# EasyEDA Pro project pcb easy eda pro stm32wb5mmg01 - Elektor.eprj, board PCB4
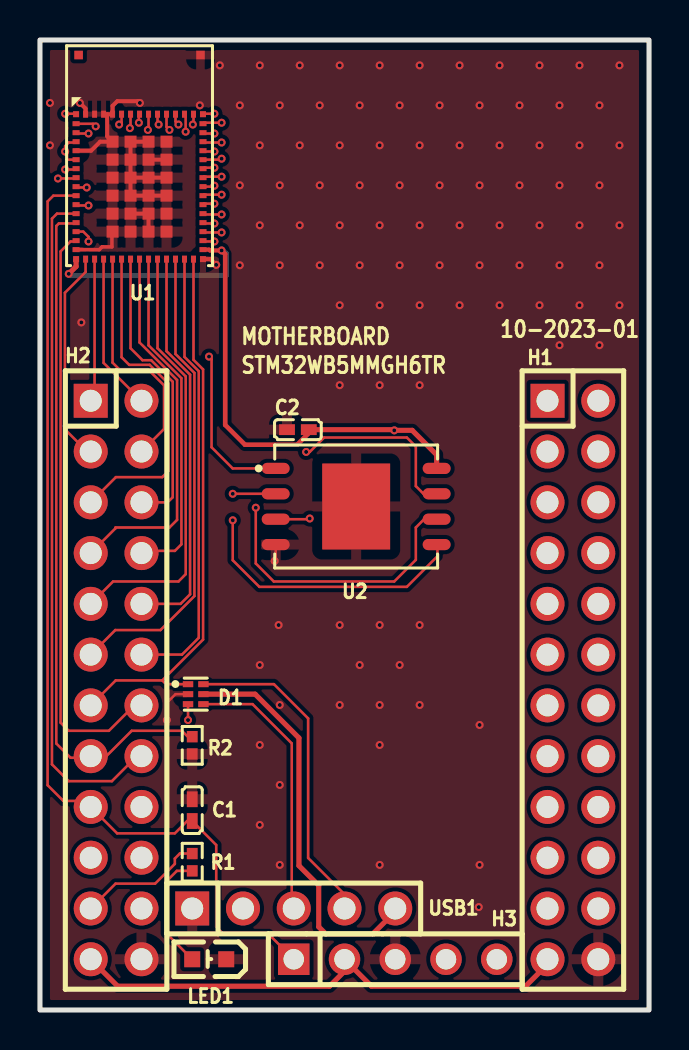
[diagram p3: board, top side]
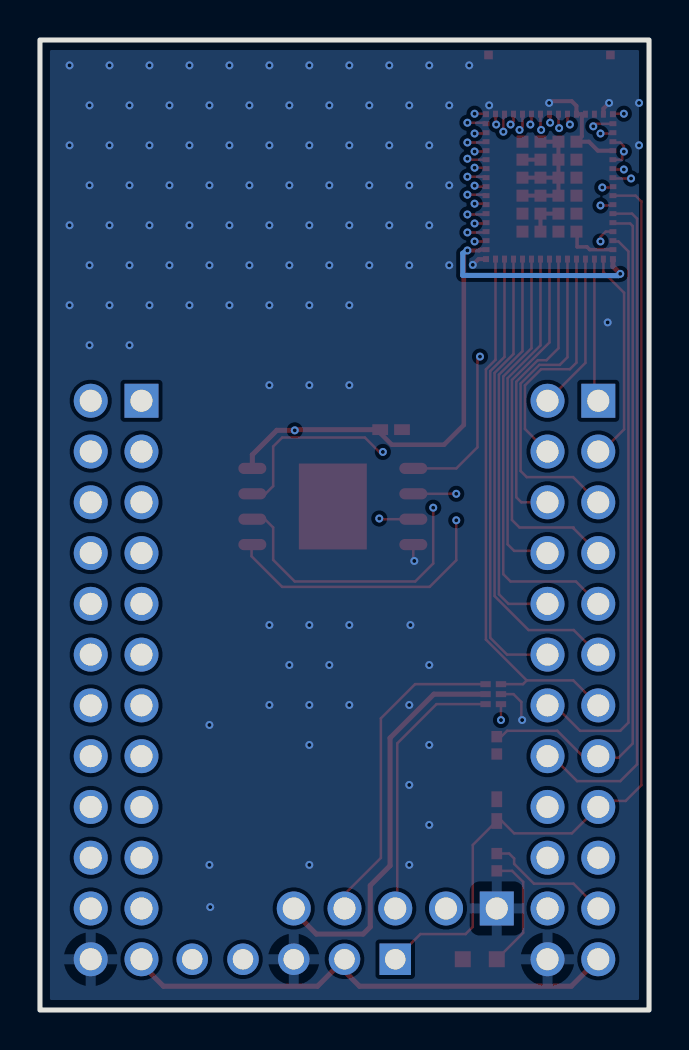
[diagram p4: board, bottom side, seen from below]

Outline 30.48 x 48.53 mm; copper layers: Top Layer, Inner1, Inner2, Bottom Layer. Coordinates in mm from the lower left corner of the outline.
Outline path: rectangle 0,48.53 30.48,0
Stack: Top Layer 0.035mm / Dielectric1 0.48mm PP er 4.5 / Inner1 0.035mm / Dielectric2 0.48mm FR4 er 4.5 / Inner2 0.035mm / Dielectric3 0.48mm PP er 4.5 / Bottom Layer 0.035mm

## Design rules (mm)
template: Custom Config
spacing copperThickness1oz (default): track to track 0.089, other pairs 0.089 to 0.3
spacing copperThickness2oz: track to track 0.203, other pairs 0.152 to 0.3
track width copperThickness1oz (default): min 0.127, default 0.254, max 2.54
track width copperThickness2oz: min 0.203, default 0.254, max 2.54
differential pair differentialPair (default): width min 0.127, default 0.254, max 2.54; gap min 0.152, default 0.152
via viaSize (default): diameter min 0.399, default 0.61, max 10; hole min 0.201, default 0.305, max 6.299

## Placement (name value [footprint] x y rotation side)
C1  100nF  [C0402]  7.62 10 270 top
C2  100nF  [C0402]  12.91 29.03 0 top
D1  PRTR5V0U2F  [SON-6_L1.5-W1.0-P0.50-BL]  7.79 15.8 270 top
H1  PZ254-2-12-Z-8.5  [HDR-TH_24P-P2.54-V-M-R2-C12-S2.54]  26.67 16.51 270 top
H2  PZ254-2-12-Z-8.5  [HDR-TH_24P-P2.54-V-M-R2-C12-S2.54]  3.81 16.51 270 top
H3  -  [HDR-TH_5P-P2.54-V-F]  17.78 2.54 0 top
LED1  19-217/R6C-AL1M2VY/3T  [LED0603-R-RD]  8.47 2.54 180 top
R1  300Ω  [R0402]  7.62 7.39 90 top
R2  10kΩ  [R0402]  7.62 13.24 90 top
U1  STM32WB5MMGH6TR  [LCC-LGA-86_L11.0-W7.3_STM32WB5MMGH6TR]  4.98 42.67 0 top
U2  W25Q256JVEIQ  [WSON-8_L8.0-W6.10-P1.27-BL-EP]  15.82 25.19 270 top
USB1  -  [HDR-TH_5P-P2.54-V-M]  12.7 5.08 0 top

## Footprints (pads in the part's own frame, mm; a bottom-side part is the same pattern mirrored in y, then rotated)
C0402
  rect 0.79x0.54 smd: 1(-0.545,0) 2(0.545,0)
HDR-TH_5P-P2.54-V-F
  rect 1.575x1.575 hole 1.02: 1(-5.08,0)
  round 1.575 hole 1.02: 2(-2.54,0) 3(0,0) 4(2.54,0) 5(5.08,0)
HDR-TH_5P-P2.54-V-M
  rect 1.7x1.7 hole 1.1: 1(-5.08,0)
  round 1.7 hole 1.1: 2(-2.54,0) 3(0,0) 4(2.54,0) 5(5.08,0)
HDR-TH_24P-P2.54-V-M-R2-C12-S2.54
  rect 1.7x1.7 hole 1.1: 1(-13.97,-1.27)
  round 1.7 hole 1.1: 2(-13.97,1.27) 3(-11.43,-1.27) 4(-11.43,1.27) 5(-8.89,-1.27) 6(-8.89,1.27) 7(-6.35,-1.27) 8(-6.35,1.27) 9(-3.81,-1.27) 10(-3.81,1.27) 11(-1.27,-1.27) 12(-1.27,1.27) 13(1.27,-1.27) 14(1.27,1.27) 15(3.81,-1.27) 16(3.81,1.27) 17(6.35,-1.27) 18(6.35,1.27) 19(8.89,-1.27) 20(8.89,1.27) 21(11.43,-1.27) 22(11.43,1.27) 23(13.97,-1.27) 24(13.97,1.27)
LCC-LGA-86_L11.0-W7.3_STM32WB5MMGH6TR
  rect 0.3x0.3 smd: 1(-3.175,2.145) 17(-3.175,-5.105) 31(3.175,-5.105) 47(3.175,2.145)
  rect 0.35x0.25 smd: 2(-3.175,1.67) 3(-3.175,1.22) 4(-3.175,0.77) 5(-3.175,0.32) 6(-3.175,-0.13) 7(-3.175,-0.58) 8(-3.175,-1.03) 9(-3.175,-1.48) 10(-3.175,-1.93) 11(-3.175,-2.38) 12(-3.175,-2.83) 13(-3.175,-3.28) 14(-3.175,-3.73) 15(-3.175,-4.18) 16(-3.175,-4.63) 32(3.175,-4.63) 33(3.175,-4.18) 34(3.175,-3.73) 35(3.175,-3.28) 36(3.175,-2.83) 37(3.175,-2.38) 38(3.175,-1.93) 39(3.175,-1.48) 40(3.175,-1.03) 41(3.175,-0.58) 42(3.175,-0.13) 43(3.175,0.32) 44(3.175,0.77) 45(3.175,1.22) 46(3.175,1.67)
  rect 0.25x0.35 smd: 18(-2.7,-5.105) 19(-2.25,-5.105) 20(-1.8,-5.105) 21(-1.35,-5.105) 22(-0.9,-5.105) 23(-0.45,-5.105) 24(0,-5.105) 25(0.45,-5.105) 26(0.9,-5.105) 27(1.35,-5.105) 28(1.8,-5.105) 29(2.25,-5.105) 30(2.7,-5.105) 48(2.7,2.145) 49(2.25,2.145) 50(1.8,2.145) 51(1.35,2.145) 52(0.9,2.145) 53(0.45,2.145) 54(0,2.145) 55(-0.45,2.145) 56(-0.9,2.145) 57(-1.35,2.145) 58(-1.8,2.145) 59(-2.25,2.145) 60(-2.7,2.145)
  rect 0.6x0.6 smd: 61(-1.35,0.77) 62(-1.35,-0.13) 63(-1.35,-1.03) 64(-1.35,-1.93) 65(-1.35,-2.83) 66(-1.35,-3.73) 67(-0.45,-3.73) 68(0.45,-3.73) 69(1.35,-3.73) 70(1.35,-2.83) 71(1.35,-1.93) 72(1.35,-1.03) 73(1.35,-0.13) 74(1.35,0.77) 75(0.45,0.77) 76(-0.45,0.77) 77(-0.45,-0.13) 78(-0.45,-1.03) 79(-0.45,-1.93) 80(-0.45,-2.83) 81(0.45,-2.83) 82(0.45,-1.93) 83(0.45,-1.03) 84(0.45,-0.13)
  rect 0.43x0.43 smd: 85(-3.05,5.105) 86(3.05,5.105)
LED0603-R-RD
  rect 0.8x0.8 smd: 1(0.851,0) 2(-0.851,0)
R0402
  rect 0.566x0.54 smd: 1(-0.433,0) 2(0.433,0)
SON-6_L1.5-W1.0-P0.50-BL
  rect 0.3x0.52 smd: 1(-0.5,-0.385) 2(0,-0.385) 3(0.5,-0.385) 4(0.5,0.385) 5(0,0.385) 6(-0.5,0.385)
WSON-8_L8.0-W6.10-P1.27-BL-EP
  oval 0.56x1.4 smd: 1(-1.905,-4.027) 2(-0.635,-4.027) 3(0.635,-4.027) 4(1.905,-4.027) 5(1.905,4.027) 6(0.635,4.027) 7(-0.635,4.027) 8(-1.905,4.027)
  rect 4.3x3.4 smd: 9(0,0)

## Nets
GND: C1.1 C2.1 D1.2 H1.24 H2.24 H3.3 LED1.2 R2.1 U1.5 U1.16 U1.31 U1.57 U1.58 U1.59 U1.60 U1.61 U1.62 U1.63 U1.64 U1.65 U1.66 U1.67 U1.68 U1.69 U1.70 U1.71 U1.72 U1.73 U1.74 U1.75 U1.76 U1.77 U1.78 U1.79 U1.80 U1.81 U1.82 U1.83 U1.84 U1.86 U2.4 U2.9 USB1.1
VBAT: H2.14 U1.15
VBUS: D1.5 USB1.5
VCC: C2.2 H1.23 H2.23 H3.2 U1.4 U1.6 U1.17 U1.32 U2.8
BOOT0: H2.15 R2.2 U1.13
D+: D1.4 USB1.3
D-: D1.6 USB1.4
I2C1_SCL: H1.8 U1.39
I2C1_SDA: H2.3 U1.18
I2C3_SCL: H1.4 U1.35
I2C3_SDA: H1.6 U1.37
IO: USB1.2
LED: H2.21 R1.2
LPTIM1_IN1: H2.1 U1.19
LPTIM2_IN1: H2.16 U1.12
LPUART1_RX: H1.16 U1.47
LPUART1_TX: H1.13 U1.46
NRST: C1.2 H2.17 H3.1 U1.10
PA0: H2.22 U1.3
PA1: H1.22 U1.2
PA8: H1.17 U1.50
PA15: H2.10 U1.27
PB0: H1.11 U1.44
PB1: H1.12 U1.43
PB2: H1.15 U1.48
PB12: H1.10 U1.41
PB15: H1.5 U1.38
PC1: H2.20 U1.9
PC4: H1.18 U1.49
PC5: H1.14 U1.45
PC6: H1.3 U1.36
PC10: H2.5 U1.22
PC11: H2.6 U1.23
PC12: H2.7 U1.24
PC13: H1.7 U1.40
PE4: H1.9 U1.42
QSPI_CLK: U1.56 U2.6
QSPI_CS: U1.1 U2.1
QSPI_IO0: U1.11 U2.5
QSPI_IO1: U1.14 U2.2
QSPI_IO2: U1.52 U2.3
QSPI_IO3: U1.53 U2.7
SPI1_CS: H1.21 U1.55
SPI1_SCK: H1.20 U1.54
SPI2_CS: H1.2 U1.33
SPI2_MISO: H2.18 U1.8
SPI2_MOSI: H2.19 U1.7
SPI2_SCK: H1.1 U1.34
SWDCK: H2.9 H3.5 U1.26
SWDIO: H2.8 H3.4 U1.25
USART1_CTS: H2.2 U1.20
USART1_RTS: H2.4 U1.21
USART1_RX: H2.11 U1.28
USART1_TX: H1.19 U1.51
USBN: D1.1 H2.13 U1.30
USBP: D1.3 H2.12 U1.29
$1N994: LED1.1 R1.1

Pads without a net: U1 85

## Via types
v1: diameter 0.4, hole 0.2, Top Layer to Bottom Layer, 146 vias

## Routing (per net, layer and track width the routed paths; a pad name or vN(x,y) marks a point on that pad's centre or on a via; arc(x,y) is an arc through that point)
GND: length 22.6
  Top Layer w0.127: v1(11.75,22.47) 11.8,22.51 U2.4 ; D1.2 6.78,15.8 6.39,15.41 6.39,14.55 v1(6.35,14.51)
  Top Layer w0.178: U1.16 2.97,38.04 3.11,38.18 3.6,38.18 3.6,38.91 U1.66
  Top Layer w0.203: U1.68 U1.81 4.53,39.84 ; U1.73 U1.84 ; U1.75 4.53,43.44 4.53,41.64 ; U1.71 U1.82 4.53,40.74 4.53,41.64 ; U1.5 2.56,42.99 3.01,43.44 U1.61 3.36,43.71 3.36,44.82 U1.57 3.63,45.23 3.87,45.47 4.91,45.47 v1(5,45.38) ; 4.53,41.64 U1.83 U1.72 ; U1.60 2.28,45.1 v1(2,45.38) ; v1(8.82,37.28) 8.53,37.57 U1.31
  vias: v1(0.5,45.38) v1(0.5,43.26) v1(2.07,34.4) v1(8,45.26) v1(9,47.26) v1(10,45.26) v1(10,41.26) v1(10,37.26) v1(11,47.26) v1(11,43.26) v1(11,39.26) v1(11,17.26) v1(11,13.26) v1(11,9.26) v1(11.94,19.26) v1(12,45.26) v1(12,41.26) v1(12,37.26) v1(12,15.26) v1(12,11.26) v1(12,7.26) v1(13,47.26) v1(13,43.26) v1(13,39.26) v1(14,45.26) v1(14,41.26) v1(14,37.26) v1(15,47.26) v1(15,43.26) v1(15,39.26) v1(15,35.26) v1(15,31.26) v1(15,19.26) v1(15,15.26) v1(16,45.26) v1(16,41.26) v1(16,37.26) v1(16,17.26) v1(17,47.26) v1(17,43.26) v1(17,39.26) v1(17,35.26) v1(17,31.26) v1(17,19.26) v1(17,15.26) v1(17,13.26) v1(17,7.26) v1(18,45.26) v1(18,41.26) v1(18,37.26) v1(18,17.26) v1(19,47.26) v1(19,43.26) v1(19,39.26) v1(19,35.26) v1(19,31.26) v1(19,19.26) v1(19,15.26) v1(20,45.26) v1(20,41.26) v1(20,37.26) v1(21,47.26) v1(21,43.26) v1(21,39.26) v1(21,35.26) v1(22,45.26) v1(22,41.26) v1(22,37.26) v1(22,14.26) v1(22,7.26) v1(21.96,5.15) v1(23,47.26) v1(23,43.26) v1(23,39.26) v1(23,35.26) v1(24,45.26) v1(24,41.26) v1(24,37.26) v1(25,47.26) v1(25,43.26) v1(25,39.26) v1(25,35.26) v1(26,45.26) v1(26,41.26) v1(26,37.26) v1(26,33.26) v1(27,47.26) v1(27,43.26) v1(27,39.26) v1(27,35.26) v1(28,45.26) v1(28,41.26) v1(28,37.26) v1(28,33.26) v1(29,47.26) v1(29,43.26) v1(29,39.26) v1(29,35.26)
VBAT: length 29
  Top Layer w0.127: U1.15 1.77,38.45 1.53,38.45 1.03,37.95 1.03,14.38 1.44,13.97 3.45,13.97 4.72,15.24
VBUS: length 20.1
  Top Layer w0.254: D1.5 10.77,15.8 12.96,13.61 12.96,7.22 13.95,6.23 13.95,4.16 14.31,3.8 16.65,3.8 17.78,4.93 USB1.5
VCC: length 101.7
  Top Layer w0.127: U1.6 1.35,42.54 1.35,42.86 v1(1.26,42.95) 1.26,43.22 1.44,43.4 1.77,43.4 U1.4
  Top Layer w0.203: U1.32 8.46,38.04 8.5,38 v1(9.09,38)
  Top Layer w0.229: v1(9.09,38) 9.27,37.82 9.27,29.27 10.26,28.28 12.87,28.28 13.45,28.86 C2.2
  Top Layer w0.254: v1(1.44,36.83) 1.81,37.2 U1.17 ; H2.23 3.89,1.19 14.49,1.19 15.24,1.94 H3.2 16.59,1.19 24.3,1.19 25.4,2.29 H1.23 ; C2.2 17.7,29.03 v1(17.73,29) 18.63,29 19.85,27.78 U2.8
  Inner2 w0.254: v1(1.26,42.95) 1.8,42.41 1.8,37.01 1.62,36.83 v1(1.44,36.83) 0.99,36.38 0.99,4.09 H2.23
  Bottom Layer w0.254: v1(1.44,36.83) 1.53,36.74 9.32,36.75 9.32,37.86 v1(9.09,38)
BOOT0: length 34.5
  Top Layer w0.127: U1.13 1.77,39.35 0.94,39.35 0.82,39.22 0.82,13.33 1.53,12.62 2.46,12.62 H2.15 3.32,12.7 4.59,13.97 7.1,13.97 7.4,13.67
D+: length 13.5
  Top Layer w0.127: 12.69,5.09 12.6,5.18 12.6,13.34 10.64,15.3 D1.4
D-: length 16.2
  Top Layer w0.127: D1.6 11.71,16.3 13.42,14.59 13.42,7.61 15.24,5.79 USB1.4
I2C1_SCL: length 38.4
  Top Layer w0.127: v1(8.73,41.24) 8.68,41.19 U1.39
  Inner2 w0.127: v1(8.73,41.24) 7.54,41.24 6.89,40.59 6.89,36.78 8.97,34.69 21.09,34.69 22.37,33.41 22.37,25.17 23.4,24.14 27.02,24.14 27.94,23.22 H1.8
I2C1_SDA: length 10.7
  Top Layer w0.127: U1.18 2.28,36.92 1.25,35.88 1.25,29.05 2.36,27.94 H2.3
I2C3_SCL: length 31.2
  Top Layer w0.127: v1(8.73,39.35) 8.2,39.35 U1.35
  Inner2 w0.127: H1.4 26.79,29.09 24.3,29.09 23.67,29.72 23.67,35.84 23.11,36.4 8.5,36.4 7.76,37.14 7.76,39.04 8.06,39.35 v1(8.73,39.35)
I2C3_SDA: length 34.5
  Top Layer w0.127: U1.37 8.21,40.34 v1(8.73,40.34)
  Inner2 w0.127: v1(8.73,40.34) 7.74,40.34 7.32,39.92 7.32,36.96 8.31,35.97 21.65,35.97 22.81,34.81 22.81,27.97 24.12,26.66 26.64,26.66 27.9,25.4 H1.6
LED: length 6.4
  Top Layer w0.127: R1.2 7,7.83 6.75,7.58 6.75,7.31 5.76,6.32 3.78,6.32 H2.21
LPTIM1_IN1: length 7.2
  Top Layer w0.127: H2.1 2.73,30.67 U1.19
LPTIM2_IN1: length 34
  Top Layer w0.127: U1.12 0.85,39.84 0.6,39.59 0.6,12.29 1.44,11.45 3.6,11.45 4.85,12.7 H2.16
LPUART1_RX: length 52.8
  Top Layer w0.127: U1.47 8.18,44.84 v1(8.73,44.84)
  Inner2 w0.127: v1(8.73,44.84) 7.47,43.58 6.51,43.58 5.15,42.22 5.15,35.37 8.28,32.24 20.34,32.24 20.64,31.94 20.64,17.41 24.17,13.88 26.67,13.88 27.85,12.7 H1.16
LPUART1_TX: length 48
  Top Layer w0.127: v1(9.09,44.39) 8.21,44.39 U1.46
  Inner2 w0.127: v1(9.09,44.39) 8.68,44.39 7.65,43.36 6.6,43.36 5.37,42.13 5.37,36.14 8.33,33.18 20.47,33.18 20.86,32.79 20.86,19.59 25.21,15.23 25.39,15.23 H1.13
NRST: length 49.4
  Top Layer w0.127: U1.10 0.67,40.74 0.38,40.45 0.38,11.25 1.17,10.46 2.24,10.46 H2.17 3.86,8.84 6.75,8.84 7.37,9.45 7.41,9.45 ; H3.1 11.44,3.8 9.18,3.8 8.82,4.16 8.82,8.25 C1.2
PA0: length 47.6
  Top Layer w0.127: U1.3 1.85,43.85 v1(2.43,43.85)
  Inner1 w0.127: H2.22 6.34,6.34 8.75,6.34 10.23,7.82 10.23,33.76 9.77,34.22 7.37,34.22 3.11,38.48 3.11,43.17 v1(2.43,43.85)
PA1: length 63.1
  Top Layer w0.127: U1.2 1.81,44.34 2.66,44.34 v1(2.79,44.21)
  Inner1 w0.127: H1.22 27.92,5.08 26.64,3.8 12.01,3.8 11.39,4.42 11.39,5.77 10.45,6.72 10.45,33.85 9.86,34.44 7.46,34.44 3.74,38.15 3.74,43.26 v1(2.79,44.21)
PA8: length 50.1
  Top Layer w0.127: U1.50 6.78,44.45 v1(6.93,44.3)
  Inner1 w0.127: v1(6.93,44.3) 6.93,37.12 8.1,35.95 13.59,35.95 14.15,35.39 14.15,13.74 15.52,12.36 23.2,12.36 25.4,10.16 H1.17
PA15: length 19.9
  Top Layer w0.127: H2.10 7.03,20.32 7.51,20.8 7.51,31.78 6.33,32.96 U1.27
PB0: length 45.5
  Top Layer w0.127: U1.44 8.2,43.4 v1(9.09,43.4)
  Inner2 w0.127: v1(9.09,43.4) 8.55,43.4 8.08,42.93 6.78,42.93 5.8,41.95 5.8,36.32 8.51,33.61 20.65,33.61 21.29,32.96 21.29,19.77 23.13,17.93 25.25,17.93 H1.11
PB1: length 46.1
  Top Layer w0.127: v1(8.73,42.95) 8.2,42.95 U1.43
  Inner2 w0.127: H1.12 26.62,19.1 23.13,19.1 21.51,20.72 21.51,33.05 20.74,33.83 8.6,33.83 6.02,36.41 6.02,41.86 6.88,42.72 8.5,42.72 v1(8.73,42.95)
PB2: length 48.3
  Top Layer w0.127: v1(7.65,44.3) 7.68,44.33 U1.48
  Inner1 w0.127: H1.15 25.3,12.8 15.75,12.8 14.58,13.97 14.58,35.57 13.77,36.38 8.28,36.38 7.65,37.01 v1(7.65,44.3)
PB12: length 42.4
  Top Layer w0.127: U1.41 8.21,42.14 v1(8.73,42.14)
  Inner2 w0.127: 21.94,33.23 20.91,34.26 8.78,34.26 6.45,36.59 6.45,41.3 7.29,42.14 v1(8.73,42.14) ; H1.10 26.82,21.44 23.04,21.44 21.94,22.54 21.94,33.23
PB15: length 33.9
  Top Layer w0.127: v1(9.09,40.79) 8.21,40.79 U1.38
  Inner2 w0.127: H1.5 24.21,25.4 22.59,27.02 22.59,34.36 21.21,35.75 8.22,35.75 7.1,36.87 7.1,40.33 7.56,40.79 v1(9.09,40.79)
PC1: length 40.7
  Top Layer w0.127: U1.9 1.85,41.15 v1(2.34,41.15)
  Inner1 w0.127: H2.20 5.12,7.58 5.58,7.58 9.29,11.29 9.29,33.15 8.89,33.55 6.74,33.55 1.93,38.36 1.93,40.74 v1(2.34,41.15)
PC4: length 52.3
  Top Layer w0.127: v1(7.29,43.94) 7.29,44.76 U1.49
  Inner1 w0.127: v1(7.29,43.94) 7.29,37.06 8.19,36.16 13.68,36.16 14.36,35.48 14.36,13.83 15.61,12.58 23.58,12.58 24.75,11.41 26.69,11.41 H1.18
PC5: length 49.1
  Top Layer w0.127: v1(8.73,43.85) 8.2,43.85 U1.45
  Inner2 w0.127: v1(8.73,43.85) 8.55,43.85 7.85,43.15 6.69,43.15 5.59,42.04 5.59,36.23 8.42,33.39 20.56,33.39 21.08,32.88 21.08,19.68 24.35,16.4 26.64,16.4 27.8,15.24 H1.14
PC6: length 30.6
  Top Layer w0.127: v1(9.09,39.8) 8.2,39.8 U1.36
  Inner2 w0.127: v1(9.09,39.8) 7.92,39.8 7.54,39.42 7.54,37.05 8.4,36.18 23.02,36.18 23.45,35.75 23.45,28.95 24.46,27.94 H1.3
PC10: length 16.7
  Top Layer w0.127: U1.22 4.08,32.66 4.46,32.28 5.49,32.28 6.43,31.34 6.43,26.97 6.12,26.66 3.8,26.66 H2.5
PC11: length 14.7
  Top Layer w0.127: 4.53,37.57 4.53,33.11 5.13,32.51 5.56,32.51 6.64,31.43 6.64,25.65 6.39,25.4 H2.6
PC12: length 18.9
  Top Layer w0.127: H2.7 3.78,24.1 3.78,24.14 6.48,24.14 6.86,24.52 6.86,31.52 4.98,33.4 U1.24
PC13: length 37.9
  Top Layer w0.127: U1.40 8.21,41.69 v1(9.09,41.69)
  Inner2 w0.127: v1(9.09,41.69) 7.51,41.69 6.67,40.86 6.67,36.69 8.88,34.47 21,34.47 22.16,33.32 22.16,23.94 23.31,22.79 25.33,22.79 H1.7
PE4: length 42.6
  Top Layer w0.127: U1.42 9.04,42.54 v1(9.09,42.59)
  Inner2 w0.127: H1.9 25.26,20.18 22.36,20.18 21.73,20.81 21.73,33.14 20.82,34.04 8.69,34.04 6.24,36.5 6.24,41.72 7.02,42.5 9,42.5 v1(9.09,42.59)
QSPI_CLK: length 38.4
  Top Layer w0.127: v1(10.8,25.13) 10.8,22.34 11.7,21.44 17.73,21.44 18.81,22.52 18.81,24.14 19.23,24.56 U2.6 ; v1(3.96,44.3) 4.08,44.42 U1.56
  Inner1 w0.127: v1(3.96,44.3) 3.96,38.24 7.55,34.65 9.95,34.65 10.66,33.94 10.66,25.27 v1(10.8,25.13)
QSPI_CS: length 25.6
  Top Layer w0.127: U2.1 9.64,27.1 8.59,28.15 8.59,32.56 v1(8.46,32.69) ; v1(1.26,44.84) 1.78,44.84 U1.1
  Inner1 w0.127: v1(8.46,32.69) 6.68,32.69 1.26,38.11 1.26,40.7 0.55,41.41 0.55,42.78 1.26,43.49 v1(1.26,44.84)
QSPI_IO0: length 35.3
  Top Layer w0.127: U2.5 19.89,23.25 19.89,22.7 18.36,21.17 10.98,21.17 9.65,22.5 v1(9.65,24.5) ; U1.11 1.85,40.25 v1(2.43,40.25)
  Inner1 w0.127: v1(2.43,40.25) 2.7,40.25 2.9,40.05 2.9,38.39 7.28,34 9.68,34 10.01,33.67 10.01,24.87 v1(9.65,24.5)
QSPI_IO1: length 20
  Top Layer w0.127: v1(9.65,25.83) U2.2 ; U1.14 2.17,38.94 2.43,38.68 v1(2.43,38.45)
  Inner1 w0.127: v1(2.43,38.45) 2.53,38.45 7.21,33.77 9.36,33.77 9.63,33.5 9.63,25.84 v1(9.65,25.83)
QSPI_IO2: length 28.5
  Top Layer w0.127: v1(13.5,24.59) 13.47,24.56 U2.3 ; v1(5.94,44.3) 5.88,44.36 U1.52
  Inner1 w0.127: v1(5.94,44.3) 5.94,37.49 7.92,35.52 13.41,35.52 13.72,35.21 13.72,25.3 13.5,25.09 v1(13.5,24.59)
QSPI_IO3: length 32.7
  Top Layer w0.127: v1(5.4,44.03) 5.43,44.06 U1.53 ; v1(13.32,27.92) 13.5,27.92 14.22,28.64 18.36,28.64 18.81,28.19 18.81,26.21 19.19,25.83 U2.7
  Inner1 w0.127: v1(13.32,27.92) 13.5,28.1 13.5,35.12 13.32,35.3 7.82,35.3 5.4,37.73 v1(5.4,44.03)
SPI1_CS: length 56.7
  Top Layer w0.127: 4.53,44.82 4.53,44.15 v1(4.5,44.12)
  Inner1 w0.127: v1(4.5,44.12) 4.5,38.01 7.64,34.87 12.37,34.87 12.75,34.48 12.75,8.24 14.76,6.23 24.25,6.23 H1.21
SPI1_SCK: length 58.6
  Top Layer w0.127: v1(4.95,44.39) 4.95,44.78 U1.54
  Inner1 w0.127: v1(4.95,44.39) 4.95,37.87 7.73,35.08 12.46,35.08 12.97,34.57 12.97,8.65 15.12,6.5 26.73,6.5 27.85,7.62 H1.20
SPI2_CS: length 27.2
  Top Layer w0.127: U1.33 8.2,38.45 v1(8.73,38.45)
  Inner2 w0.127: 27.49,30.93 27.49,36.16 26.82,36.83 8.68,36.83 8.19,37.32 8.19,38.32 8.32,38.45 v1(8.73,38.45)
SPI2_MISO: length 40.4
  Top Layer w0.127: v1(0.9,41.6) 1.77,41.6 U1.8
  Inner1 w0.127: v1(0.9,41.6) 1.49,41.01 1.49,38.18 6.55,33.12 8.71,33.12 8.86,32.97 8.86,11.49 6.93,9.56 5.68,9.56 H2.18
SPI2_MOSI: length 43.8
  Top Layer w0.127: v1(1.26,42.05) 1.77,42.05 U1.7
  Inner1 w0.127: H2.19 3.76,8.84 6.52,8.84 9.08,11.4 9.08,33.06 8.8,33.34 6.65,33.34 1.71,38.27 1.71,41.6 v1(1.26,42.05)
SPI2_SCK: length 27.2
  Top Layer w0.127: U1.34 8.2,38.9 v1(9.09,38.9)
  Inner2 w0.127: H1.1 25.53,30.61 25.53,36.05 24.97,36.61 8.59,36.61 7.97,37.23 7.97,38.5 8.37,38.9 v1(9.09,38.9)
SWDCK: length 65.3
  Top Layer w0.127: U1.26 5.88,33.11 7.29,31.7 7.29,21.8 6.93,21.44 3.66,21.44 H2.9
  Inner2 w0.127: H3.5 22.86,1.91 22.23,1.28 19.71,1.28 18.99,2 18.99,3.53 20.21,4.75 20.21,20.54 19.8,20.95 11.88,20.95 10.19,22.64 7.14,22.64 6.03,21.53 3.75,21.53 H2.9
SWDIO: length 51.5
  Top Layer w0.127: H2.8 5.19,22.97 6.75,22.97 7.08,23.3 7.08,31.61 5.43,33.25 U1.25
  Inner2 w0.127: H3.4 20.43,2.65 20.43,20.63 19.89,21.17 11.97,21.17 10.28,22.86 H2.8
USART1_CTS: length 7.9
  Top Layer w0.127: U1.20 3.18,32.38 H2.2
USART1_RTS: length 12
  Top Layer w0.127: H2.4 6.21,29.07 6.21,31.25 5.4,32.06 3.96,32.06 3.63,32.39 U1.21
USART1_RX: length 23.7
  Top Layer w0.127: H2.11 3.77,19.01 6.03,19.01 7.73,20.71 7.73,31.87 6.78,32.82 U1.28
USART1_TX: length 54
  Top Layer w0.127: U1.51 6.33,44.18 v1(6.48,44.03)
  Inner1 w0.127: v1(6.48,44.03) 6.48,37.26 8.01,35.73 13.5,35.73 13.93,35.3 13.93,9.31 15.12,8.12 24.9,8.12 H1.19
USBN: length 27.6
  Top Layer w0.127: D1.1 6.31,16.3 6.12,16.49 ; 6.12,16.49 3.79,16.49 H2.13 ; 6.12,16.49 8.16,18.53 8.16,32.05 7.68,32.53 U1.30
USBP: length 27.7
  Top Layer w0.127: H2.12 7.1,17.78 7.95,18.62 7.95,31.96 7.23,32.67 U1.29 ; D1.3 v1(7.41,14.51)
  Inner1 w0.127: H2.12 5.08,17.71 6.3,16.49 6.3,15.23 6.9,14.63 7.28,14.63 v1(7.41,14.51)
$1N994: length 6
  Top Layer w0.127: R1.1 6.85,6.96 6.3,6.41 6.3,3.86 LED1.1

## Copper pours and planes (outline as drawn; the poured copper is in the pictures)
GND on Top Layer: 0,48.53 30.48,48.53 30.48,0 0,0
GND on Bottom Layer: 0,48.26 30.48,48.26 30.48,0 0,0
GND on Bottom Layer: 0,48.47 30.48,48.47 30.48,0.21 0,0.21
GND on Bottom Layer: 0,48.26 30.48,48.26 30.48,0 0,0
GND on Inner1: 0,48.53 30.48,48.53 30.48,0 0,0
GND on Inner2: 0,48.53 30.48,48.53 30.48,0 0,0

## Text on the board
Document Layer: LPTIM1_IN1/USART1_CTS / I2C1_SDA/USART1_RTS / PC10/PC11 / PC12/SWDIO / SWDCK/PA15 / USART1_RX/USBP / USBN/VBAT / BOOT0/LPTIM2_IN1 / NRST/SPI2_MISO / SPI2_MOSI/PC1 / LED/PA0 / VCC/GND | SPI2_SCK/SPI2CS / PC6/I2C3_SCL / PB15/I2C3_SDA / PC13/I2C1_SCL / PE4/PB12 / PB0/PB1 / LPUART1_TX/PC5 / PB2/LPUART1_RX / PA8/PC4 / USART1_TX/SPI1_SCK / SPI1_CS/PA1 / VCC/GND | USB VBUS / D- / D+ / IO / GND | SWDCK / SWDIO / GND / VCC / NRST
Top Silkscreen Layer: MOTHERBOARD | STM32WB5MMGH6TR | 10-2023-01
